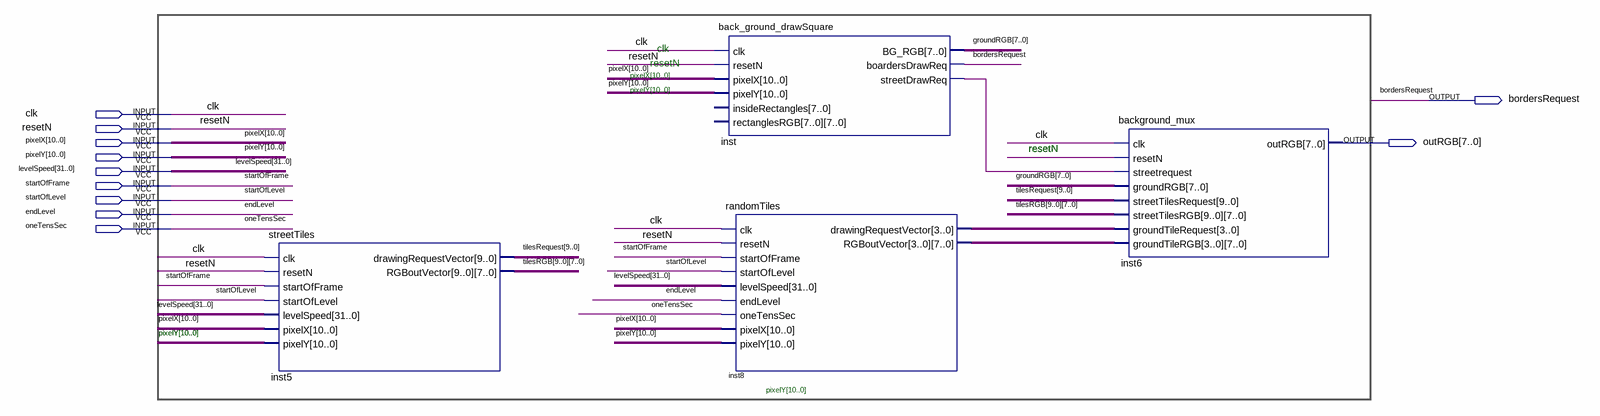
[diagram p0: schematic sheet]
// Quartus schematic BACKGROUND_TOP.bdf as structural Verilog: 4 symbols, 11 pins
module BACKGROUND_TOP (
  input  clk,
  input  resetN,
  input  [10:0] pixelX,
  input  [10:0] pixelY,
  input  [31:0] levelSpeed,
  input  startOfFrame,
  input  startOfLevel,
  input  endLevel,
  input  oneTensSec,
  output bordersRequest,
  output [7:0] outRGB
);

  wire inst_streetdrawreq;
  wire [3:0] inst8_drawingrequestvector;
  wire [7:0] groundRGB, tilesRGB_0, tilesRGB_1, tilesRGB_2, tilesRGB_3, tilesRGB_4, tilesRGB_5, tilesRGB_6,
       tilesRGB_7, tilesRGB_8, tilesRGB_9;
  wire [9:0] tilesRequest;
  wire [31:0] inst8_rgboutvector;

  streetTiles inst5 (
    .clk(clk), .resetN(resetN), .startOfFrame(startOfFrame), .startOfLevel(startOfLevel),
    .levelSpeed(levelSpeed), .pixelX(pixelX), .pixelY(pixelY), .drawingRequestVector(tilesRequest),
    .RGBoutVector({tilesRGB_9, tilesRGB_8, tilesRGB_7, tilesRGB_6, tilesRGB_5, tilesRGB_4, tilesRGB_3, tilesRGB_2, tilesRGB_1, tilesRGB_0}));
  back_ground_drawSquare inst (
    .clk(clk), .resetN(resetN), .pixelX(pixelX), .pixelY(pixelY), .BG_RGB(groundRGB),
    .boardersDrawReq(bordersRequest), .streetDrawReq(inst_streetdrawreq));  // open: insideRectangles, rectanglesRGB
  randomTiles inst8 (
    .clk(clk), .resetN(resetN), .startOfFrame(startOfFrame), .startOfLevel(startOfLevel),
    .levelSpeed(levelSpeed), .endLevel(endLevel), .oneTensSec(oneTensSec), .pixelX(pixelX), .pixelY(pixelY),
    .drawingRequestVector(inst8_drawingrequestvector), .RGBoutVector(inst8_rgboutvector));
  background_mux inst6 (
    .clk(clk), .resetN(resetN), .streetrequest(inst_streetdrawreq), .groundRGB(groundRGB),
    .streetTilesRequest(tilesRequest),
    .streetTilesRGB({tilesRGB_9, tilesRGB_8, tilesRGB_7, tilesRGB_6, tilesRGB_5, tilesRGB_4, tilesRGB_3, tilesRGB_2, tilesRGB_1, tilesRGB_0}),
    .groundTileRequest(inst8_drawingrequestvector), .groundTileRGB(inst8_rgboutvector), .outRGB(outRGB));

  // Notes on the sheet:
  //   clk
  //   resetN
  //   pixelX[10..0]
  //   pixelY[10..0]
  //   resetN
  //   pixelY[10..0]
  //   pixelY[10..0]
endmodule
